# EAGLE schematic coil-control-module-v1 (EAGLE 7.1.0)
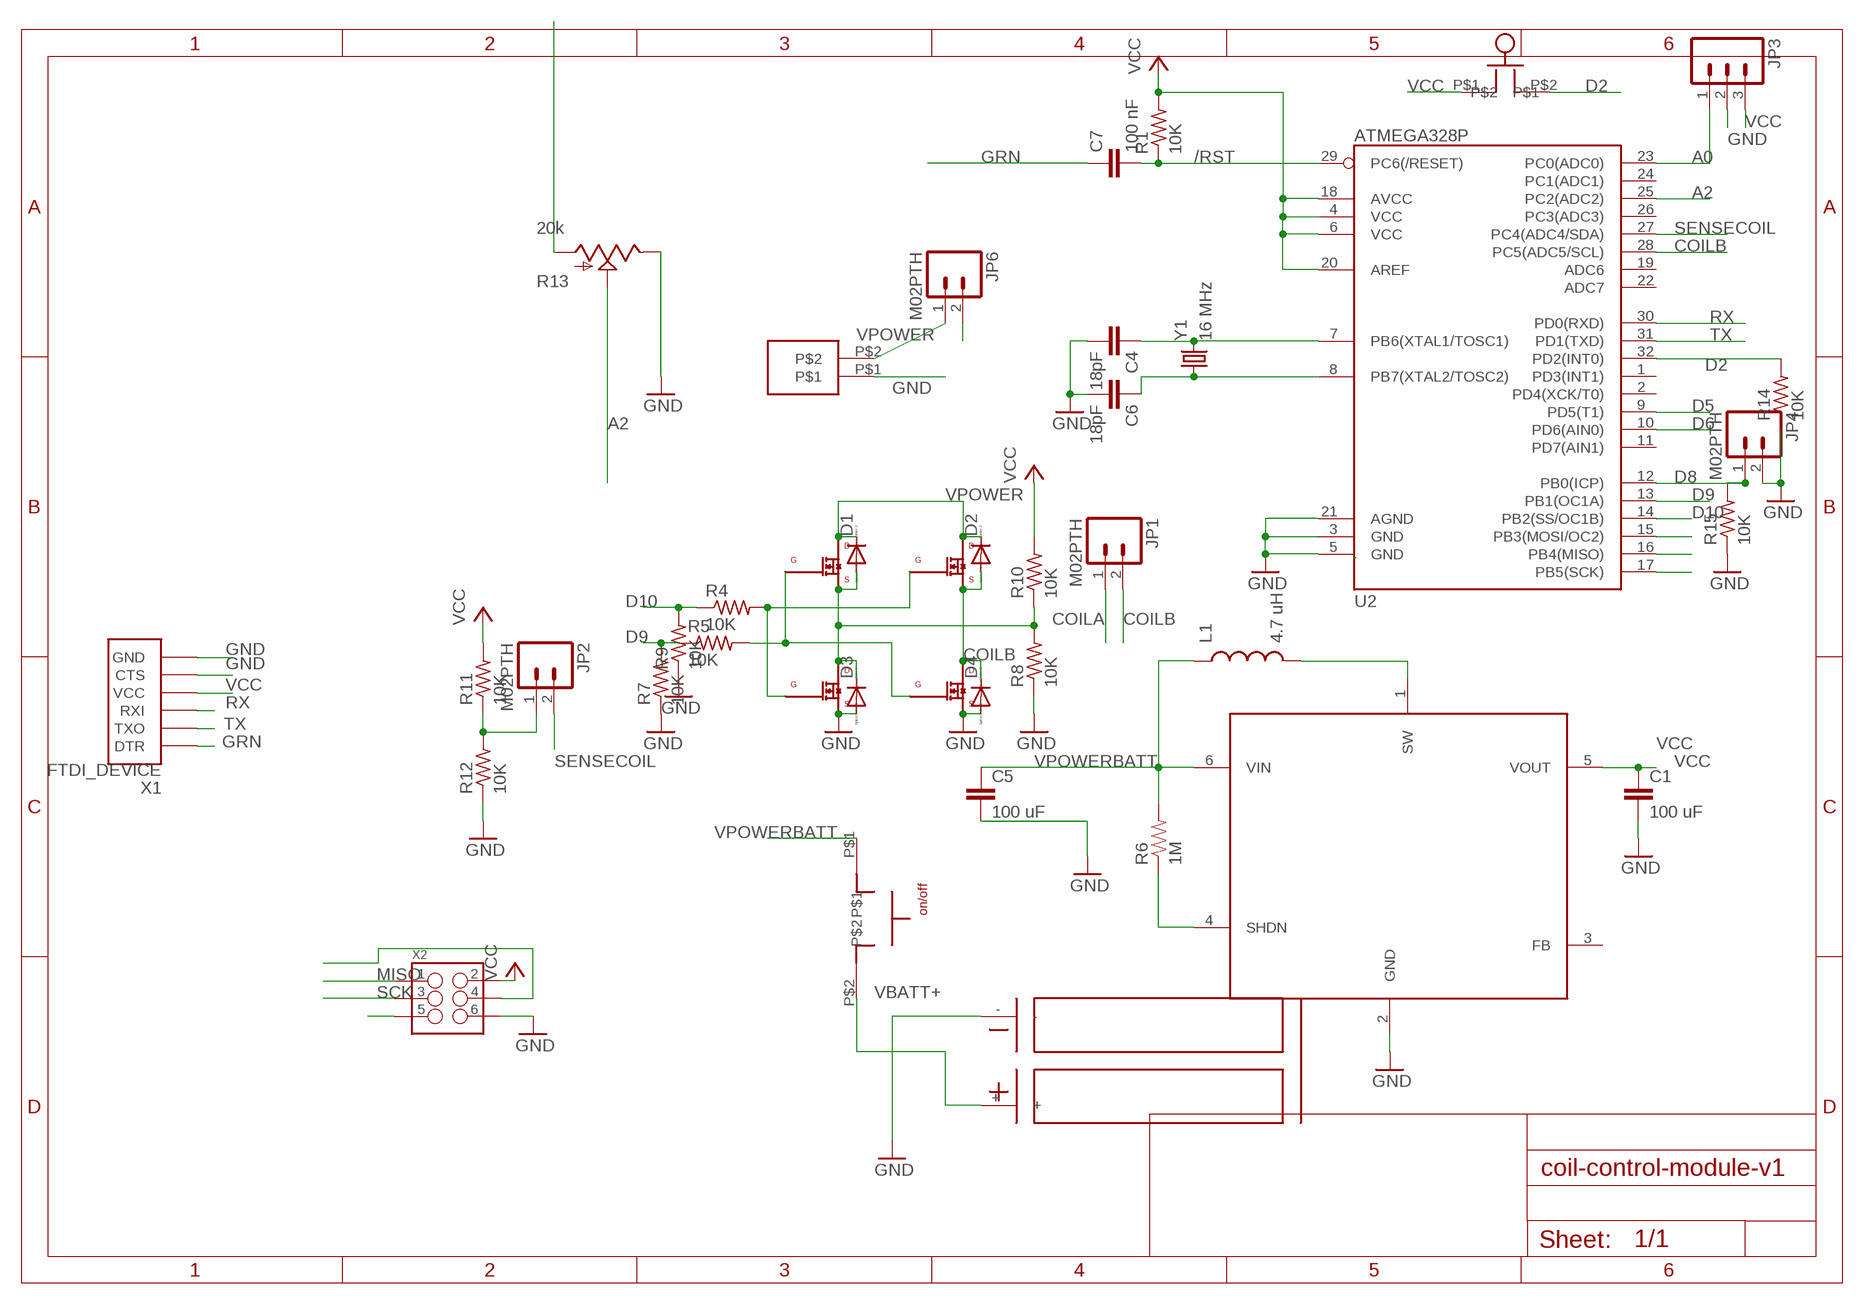
[diagram p0: schematic, sheet 1]

## Parts
C1  100 uF  CAP1206  [1206]
C4  18pF  C-EUC0603  [C0603]
C5  100 uF  CAP1206  [1206]
C6  18pF  C-EUC0603  [C0603]
C7  100 nF  CAP0603-CAP  [0603-CAP]
D1  DIODE-DO-214AC  [DO-214AC]
D2  DIODE-DO-214AC  [DO-214AC]
D3  DIODE-DO-214AC  [DO-214AC]
D4  DIODE-DO-214AC  [DO-214AC]
JP1  M02PTH  [1X02]
JP2  M02PTH  [1X02]
JP3  M03PTH  [1X03]
JP4  M02PTH  [1X02]
JP6  M02PTH  [1X02]
L1  4.7 uH  INDUCTOR0805  [0805]
R1  10K  R-US_R0603  [R0603]
R4  10K  R-US_R0603  [R0603]
R5  10K  R-US_R0603  [R0603]
R6  1M  RESISTOR0805-RES  [0805]
R7  10K  R-US_R0603  [R0603]
R8  10K  R-US_R0603  [R0603]
R9  10K  R-US_R0603  [R0603]
R10  10K  R-US_R0603  [R0603]
R11  10K  R-US_R0603  [R0603]
R12  10K  R-US_R0603  [R0603]
R13  20k  POTALPS-KIT  [ALPS_POT_KIT]
R14  10K  R-US_R0603  [R0603]
R15  10K  R-US_R0603  [R0603]
U1  AAT1217  [SSOT23-6]
U2  ATMEGA328P  ATMEGA328_SMT  [TQFP32-08]
U$1  IRLML0060  [SOT-23]
U$2  IRLML0060  [SOT-23]
U$3  IRLML0060  [SOT-23]
U$4  AA-DOUBLE-UPSIDE-DOWN  [AA-DOUBLE-UPSIDE-DOWN]
U$5  CW182-ND  [CW182-ND]
U$6  IRLML0060  [SOT-23]
U$7  BUTTON  [BUTTON]
U$8  SPRING-TERMINAL  [SPRING-TERMINAL]
X1  FTDI_DEVICE  [FTDI_DEVICE_SIDE]
X2  M03X2NO_SILK  [2X3-NS]
Y1  16 MHz  CRYSTAL5X3  [CRYSTAL-SMD-5X3]

## Nets
/RST: C7.2 R1.1 U2.29(PC6(/RESET)) X2.5
A0: JP3.1 U2.23(PC0(ADC0))
A2: R13.P$2(S) U2.25(PC2(ADC2))
COILA: D1.A D3.C JP1.1 R8.2 R10.1 U$3.2(SOURCE) U$6.3(DRAIN)
COILB: D2.A D4.C JP1.2 U2.28(PC5(ADC5/SCL)) U$1.3(DRAIN) U$2.2(SOURCE)
D2: R14.2 U2.32(PD2(INT0)) U$7.P$2
D5: U2.9(PD5(T1))
D6: U2.10(PD6(AIN0))
D8: JP4.1 R15.2 U2.12(PB0(ICP))
D9: R5.1 R7.2 U2.13(PB1(OC1A))
D10: R4.1 R9.2 U2.14(PB2(SS/OC1B))
GND: C1.2 C4.2 C5.2 C6.2 D3.A D4.A JP3.2 JP4.2 R7.1 R8.1 R9.1 R12.1 R13.P$1(E) R14.1 R15.1 U1.2(GND) U2.3(GND) U2.5(GND) U2.21(AGND) U$1.2(SOURCE) U$4.- U$6.2(SOURCE) U$8.P$1 X1.P$5(CTS) X1.P$6(GND) X2.6
GRN: C7.1 X1.P$1(DTR)
MISO: U2.16(PB4(MISO)) X2.1
MOSI: U2.15(PB3(MOSI/OC2)) X2.4
N$4: C4.1 U2.7(PB6(XTAL1/TOSC1)) Y1.3
N$11: C6.1 U2.8(PB7(XTAL2/TOSC2)) Y1.1
N$13: JP2.1 R11.1 R12.2
N$14: L1.2 U1.1(SW)
N$26: R5.2 U$1.1(GATE) U$3.1(GATE)
N$27: R4.2 U$2.1(GATE) U$6.1(GATE)
RX: U2.30(PD0(RXD)) X1.P$3(RXI)
SCK: U2.17(PB5(SCK)) X2.3
SENSECOIL: JP2.2 U2.27(PC4(ADC4/SDA))
SHDN: R6.1 U1.4(SHDN)
TX: U2.31(PD1(TXD)) X1.P$2(TXO)
VBATT+: U$4.+ U$5.P$2
VCC: C1.1 JP3.3 R1.2 R10.2 R11.2 R13.P$3(A) U1.5(VOUT) U2.4(VCC) U2.6(VCC) U2.18(AVCC) U2.20(AREF) U$7.P$1 X1.P$4(VCC) X2.2
VPOWER: D1.C D2.C JP6.1 U$2.3(DRAIN) U$3.3(DRAIN) U$8.P$2
VPOWERBATT: C5.1 JP6.2 L1.1 R6.2 U1.6(VIN) U$5.P$1
Unconnected: U1.3(FB) U2.1(PD3(INT1)) U2.2(PD4(XCK/T0)) U2.11(PD7(AIN1)) U2.19(ADC6) U2.22(ADC7) U2.24(PC1(ADC1)) U2.26(PC3(ADC3))

## Library data of the parts
C1 C5 = SparkFun-Capacitors:CAP: Capacitor Standard 0603 ceramic capacitor, and 0.1" leaded capacitor.
C4 C6 = resistor:C-EU: CAPACITOR, European symbol
C7 = SparkFun-Passives:CAP: Capacitor Standard 0603 ceramic capacitor, and 0.1" leaded capacitor.
D1-D4 = diode:DIODE-: DIODE
JP1 JP2 JP4 JP6 = SparkFun-Connectors:M02: Standard 2-pin 0.1" header. Use with - straight break away headers ( PRT-00116) - right angle break away headers (PRT-00553) - swiss pins (PRT-00743) - machine pins (PRT-00117) - female headers (PRT-00115) Molex polarized connector foot print use with: PRT-08233 with associated crimp pins and housings. 2.54_SCREWTERM for use with PRT-10571. 3.5mm Screw Terminal footprints for PRT-08084 5mm Screw Terminal footprints for use with PRT-08432
JP3 = SparkFun-Connectors:M03: Header 3 Standard 3-pin 0.1" header. Use with straight break away headers (SKU : PRT-00116), right angle break away headers (PRT-00553), swiss pins (PRT-00743), machine pins (PRT-00117), and female headers (PRT-00115). Molex polarized connector foot print use with SKU : PRT-08232 with associated crimp pins and housings.
L1 = SparkFun-Passives:INDUCTOR: Inductors Basic Inductor/Choke - 0603 and 1206. Footprints are not proven and vary greatly between part numbers. SRN6045- 33uH, 20% 1.4A SDR0403-560KL - 56uH, 10%, 500mA RMS/740mA peak
R1 R4 R5 R7-R12 R14 R15 = resistor:R-US_: RESISTOR, American symbol
R6 = SparkFun-Passives:RESISTOR: Resistor Basic schematic elements and footprints for 0603, 1206, and PTH resistors.
R13 = SparkFun-Electromechanical:POT
U1 = spietz-library:AAT1217
U2 = SparkFun-DigitalIC:ATMEGA328_SMT: 32-Pin Atmega328 part Commonly used on Arduino compatible boards Available in QFP and QFN packages TQFP is IC-09069 QFN is non-stock; PROD_ID: IC-09069
U$1-U$3 U$6 = spietz-library:IRLML0060
U$4 = spietz-library:AA-DOUBLE-UPSIDE-DOWN
U$5 = spietz-library:CW182-ND
U$7 = spietz-library:BUTTON
U$8 = spietz-library:SPRING-TERMINAL
X1 = SparkFun-Connectors:FTDI_DEVICE: Connector which mates to FTDI basic or FTDI cable.
X2 = SparkFun-Connectors:M03X2: 2x3 .1" header. Shrouded, with keying- CONN-10681 SMT- CONN-11415 Pogo pins- HW-11044
Y1 = SparkFun-FreqCtrl:CRYSTAL: Various standard crystals. Proven footprints. Spark Fun Electronics SKU : COM-00534

## Net classes
1 vcc: width 0.254 mm